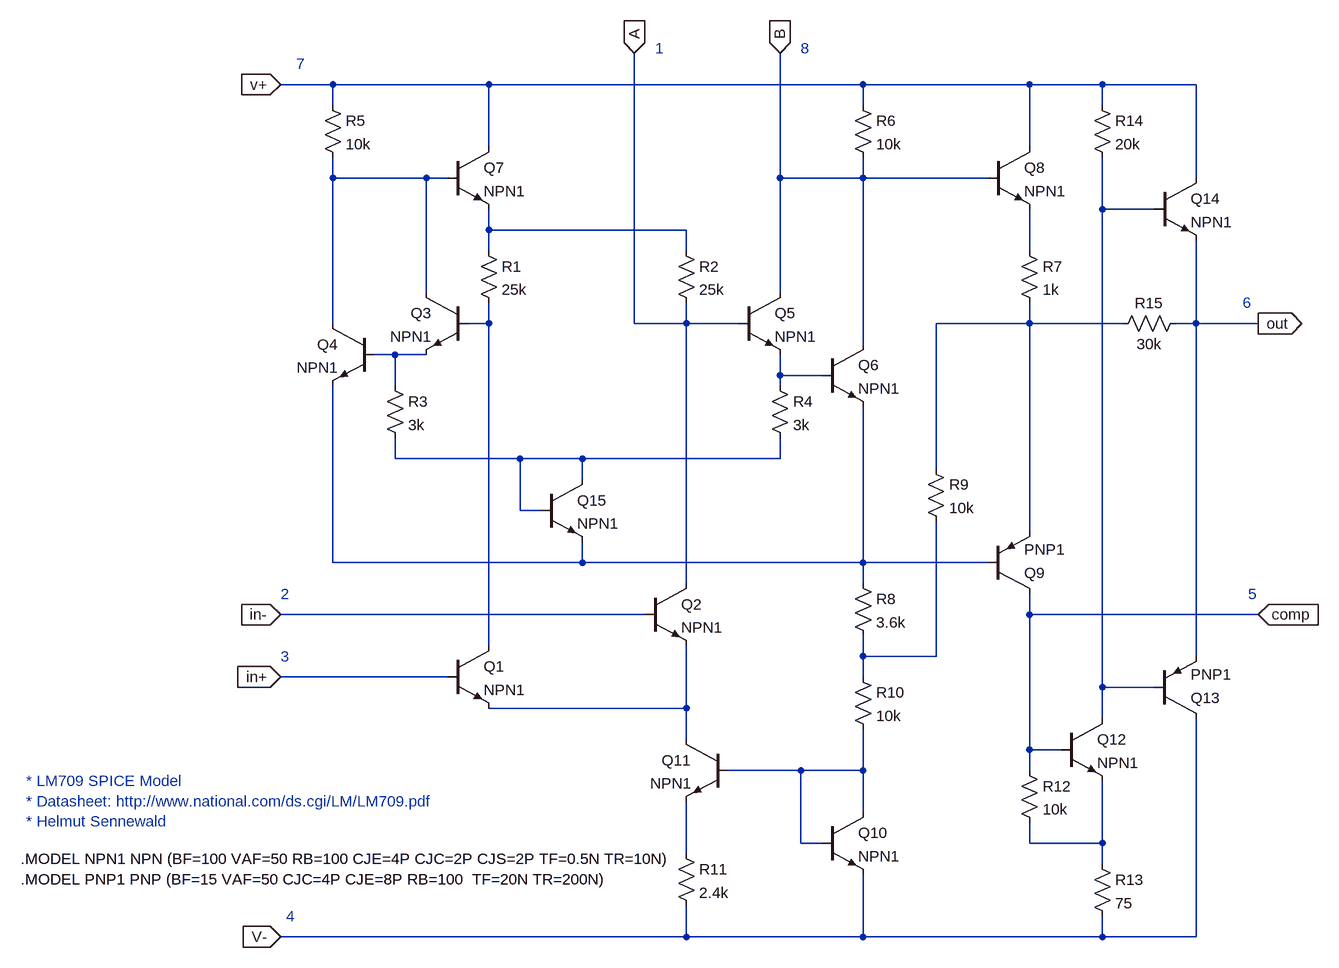
[diagram p0: schematic lm709hy.asc]
lm709hy.asc, the LTspice schematic file:
Version 4
SHEET 1 1324 1400
WIRE -288 0 -368 0
WIRE -288 32 -288 0
WIRE -288 144 -288 112
WIRE -288 368 -288 144
WIRE -288 736 -288 464
WIRE -192 416 -224 416
WIRE -192 464 -192 416
WIRE -192 576 -192 544
WIRE -144 144 -288 144
WIRE -144 320 -144 144
WIRE -144 416 -192 416
WIRE -112 144 -144 144
WIRE -112 912 -368 912
WIRE -48 0 -288 0
WIRE -48 96 -48 0
WIRE -48 224 -48 192
WIRE -48 256 -48 224
WIRE -48 368 -80 368
WIRE -48 368 -48 336
WIRE -48 864 -48 368
WIRE 0 576 -192 576
WIRE 0 656 0 576
WIRE 32 656 0 656
WIRE 96 576 0 576
WIRE 96 608 96 576
WIRE 96 736 -288 736
WIRE 96 736 96 704
WIRE 176 368 176 -48
WIRE 192 816 -368 816
WIRE 256 224 -48 224
WIRE 256 256 256 224
WIRE 256 368 176 368
WIRE 256 368 256 336
WIRE 256 768 256 368
WIRE 256 960 -48 960
WIRE 256 960 256 864
WIRE 256 1008 256 960
WIRE 256 1184 256 1104
WIRE 256 1312 -368 1312
WIRE 256 1312 256 1264
WIRE 336 368 256 368
WIRE 400 144 400 -48
WIRE 400 320 400 144
WIRE 400 448 400 416
WIRE 400 464 400 448
WIRE 400 576 96 576
WIRE 400 576 400 544
WIRE 432 1056 320 1056
WIRE 432 1168 432 1056
WIRE 464 448 400 448
WIRE 464 1168 432 1168
WIRE 528 0 -48 0
WIRE 528 32 528 0
WIRE 528 144 400 144
WIRE 528 144 528 112
WIRE 528 400 528 144
WIRE 528 736 96 736
WIRE 528 736 528 496
WIRE 528 768 528 736
WIRE 528 880 528 848
WIRE 528 912 528 880
WIRE 528 1056 432 1056
WIRE 528 1056 528 992
WIRE 528 1120 528 1056
WIRE 528 1312 256 1312
WIRE 528 1312 528 1216
WIRE 640 592 640 368
WIRE 640 880 528 880
WIRE 640 880 640 672
WIRE 720 144 528 144
WIRE 720 736 528 736
WIRE 784 0 528 0
WIRE 784 96 784 0
WIRE 784 256 784 192
WIRE 784 368 640 368
WIRE 784 368 784 336
WIRE 784 688 784 368
WIRE 784 816 784 784
WIRE 784 1024 784 816
WIRE 784 1056 784 1024
WIRE 784 1168 784 1136
WIRE 832 1024 784 1024
WIRE 896 0 784 0
WIRE 896 32 896 0
WIRE 896 192 896 112
WIRE 896 928 896 192
WIRE 896 976 896 928
WIRE 896 1168 784 1168
WIRE 896 1168 896 1072
WIRE 896 1200 896 1168
WIRE 896 1312 528 1312
WIRE 896 1312 896 1280
WIRE 928 368 784 368
WIRE 976 192 896 192
WIRE 976 928 896 928
WIRE 1040 0 896 0
WIRE 1040 144 1040 0
WIRE 1040 368 1008 368
WIRE 1040 368 1040 240
WIRE 1040 880 1040 368
WIRE 1040 1312 896 1312
WIRE 1040 1312 1040 976
WIRE 1136 368 1040 368
WIRE 1136 816 784 816
FLAG 1136 368 out
IOPIN 1136 368 Out
FLAG 1136 816 comp
IOPIN 1136 816 In
FLAG -368 912 in+
IOPIN -368 912 In
FLAG -368 816 in-
IOPIN -368 816 In
FLAG -368 0 v+
IOPIN -368 0 In
FLAG -368 1312 V-
IOPIN -368 1312 In
FLAG 176 -48 A
IOPIN 176 -48 In
FLAG 400 -48 B
IOPIN 400 -48 In
SYMBOL npn -112 96 R0
SYMATTR InstName Q7
SYMATTR Value NPN1
SYMBOL res -304 16 R0
SYMATTR InstName R5
SYMATTR Value 10k
SYMBOL npn -80 320 M0
SYMATTR InstName Q3
SYMATTR Value NPN1
SYMBOL npn -224 368 M0
SYMATTR InstName Q4
SYMATTR Value NPN1
SYMBOL res -64 240 R0
SYMATTR InstName R1
SYMATTR Value 25k
SYMBOL res -208 448 R0
SYMATTR InstName R3
SYMATTR Value 3k
SYMBOL npn 32 608 R0
SYMATTR InstName Q15
SYMATTR Value NPN1
SYMBOL res 240 240 R0
SYMATTR InstName R2
SYMATTR Value 25k
SYMBOL npn 192 768 R0
SYMATTR InstName Q2
SYMATTR Value NPN1
SYMBOL npn -112 864 R0
SYMATTR InstName Q1
SYMATTR Value NPN1
SYMBOL npn 336 320 R0
SYMATTR InstName Q5
SYMATTR Value NPN1
SYMBOL res 384 448 R0
SYMATTR InstName R4
SYMATTR Value 3k
SYMBOL npn 464 400 R0
SYMATTR InstName Q6
SYMATTR Value NPN1
SYMBOL res 512 16 R0
SYMATTR InstName R6
SYMATTR Value 10k
SYMBOL res 512 752 R0
SYMATTR InstName R8
SYMATTR Value 3.6k
SYMBOL res 512 896 R0
SYMATTR InstName R10
SYMATTR Value 10k
SYMBOL npn 464 1120 R0
SYMATTR InstName Q10
SYMATTR Value NPN1
SYMBOL npn 320 1008 M0
SYMATTR InstName Q11
SYMATTR Value NPN1
SYMBOL res 240 1168 R0
SYMATTR InstName R11
SYMATTR Value 2.4k
SYMBOL res 624 576 R0
SYMATTR InstName R9
SYMATTR Value 10k
SYMBOL npn 720 96 R0
SYMATTR InstName Q8
SYMATTR Value NPN1
SYMBOL res 768 240 R0
SYMATTR InstName R7
SYMATTR Value 1k
SYMBOL pnp 720 784 M180
SYMATTR InstName Q9
SYMATTR Value PNP1
SYMBOL res 880 1184 R0
SYMATTR InstName R13
SYMATTR Value 75
SYMBOL res 768 1040 R0
SYMATTR InstName R12
SYMATTR Value 10k
SYMBOL npn 832 976 R0
SYMATTR InstName Q12
SYMATTR Value NPN1
SYMBOL pnp 976 976 M180
SYMATTR InstName Q13
SYMATTR Value PNP1
SYMBOL npn 976 144 R0
SYMATTR InstName Q14
SYMATTR Value NPN1
SYMBOL res 880 16 R0
SYMATTR InstName R14
SYMATTR Value 20k
SYMBOL res 912 384 R270
WINDOW 0 32 56 VTop 0
WINDOW 3 0 56 VBottom 0
SYMATTR InstName R15
SYMATTR Value 30k
TEXT -768 1192 Left 0 !.MODEL NPN1 NPN (BF=100 VAF=50 RB=100 CJE=4P CJC=2P CJS=2P TF=0.5N TR=10N)\n.MODEL PNP1 PNP (BF=15 VAF=50 CJC=4P CJE=8P RB=100  TF=20N TR=200N)
TEXT 208 -56 Left 0 ;1
TEXT 432 -56 Left 0 ;8
TEXT -344 -32 Left 0 ;7
TEXT 1112 336 Left 0 ;6
TEXT 1120 784 Left 0 ;5
TEXT -368 784 Left 0 ;2
TEXT -368 880 Left 0 ;3
TEXT -360 1280 Left 0 ;4
TEXT -760 1072 Left 0 ;* LM709 SPICE Model\n* Datasheet: http://www.national.com/ds.cgi/LM/LM709.pdf\n* Helmut Sennewald

The netlist it stands for:
* lm709hy.asc
Q7 v+ N001 N005 0 NPN1
R5 v+ N001 10k
Q3 N001 N006 N003 0 NPN1
Q4 N001 N003 N002 0 NPN1
R1 N005 N006 25k
R3 N003 N004 3k
Q15 N004 N004 N002 0 NPN1
R2 N005 A 25k
Q2 A in- N007 0 NPN1
Q1 N006 in+ N007 0 NPN1
Q5 B A N009 0 NPN1
R4 N009 N004 3k
Q6 B N009 N002 0 NPN1
R6 v+ B 10k
R8 N002 N011 3.6k
R10 N011 N010 10k
Q10 N010 N010 V- 0 NPN1
Q11 N007 N010 N008 0 NPN1
R11 N008 V- 2.4k
R9 N012 N011 10k
Q8 v+ B N013 0 NPN1
R7 N013 N012 1k
Q9 comp N002 N012 0 PNP1
R13 N014 V- 75
R12 comp N014 10k
Q12 N015 comp N014 0 NPN1
Q13 V- N015 out 0 PNP1
Q14 v+ N015 out 0 NPN1
R14 v+ N015 20k
R15 N012 out 30k
.model NPN NPN
.model PNP PNP
.lib standard.bjt
.MODEL NPN1 NPN (BF=100 VAF=50 RB=100 CJE=4P CJC=2P CJS=2P TF=0.5N TR=10N)
.MODEL PNP1 PNP (BF=15 VAF=50 CJC=4P CJE=8P RB=100  TF=20N TR=200N)
* 1
* 8
* 7
* 6
* 5
* 2
* 3
* 4
* * LM709 SPICE Model
* * Datasheet: http://www.national.com/ds.cgi/LM/LM709.pdf
* * Helmut Sennewald
.backanno
.end